# EasyEDA schematic Rollator_2020-08-11_09-29-25.json
TITLE: Rollator; REV: 1.0; Date: 2020-08-06; Sheet: 1/1; Drawn By: grizzie17; Company: Me
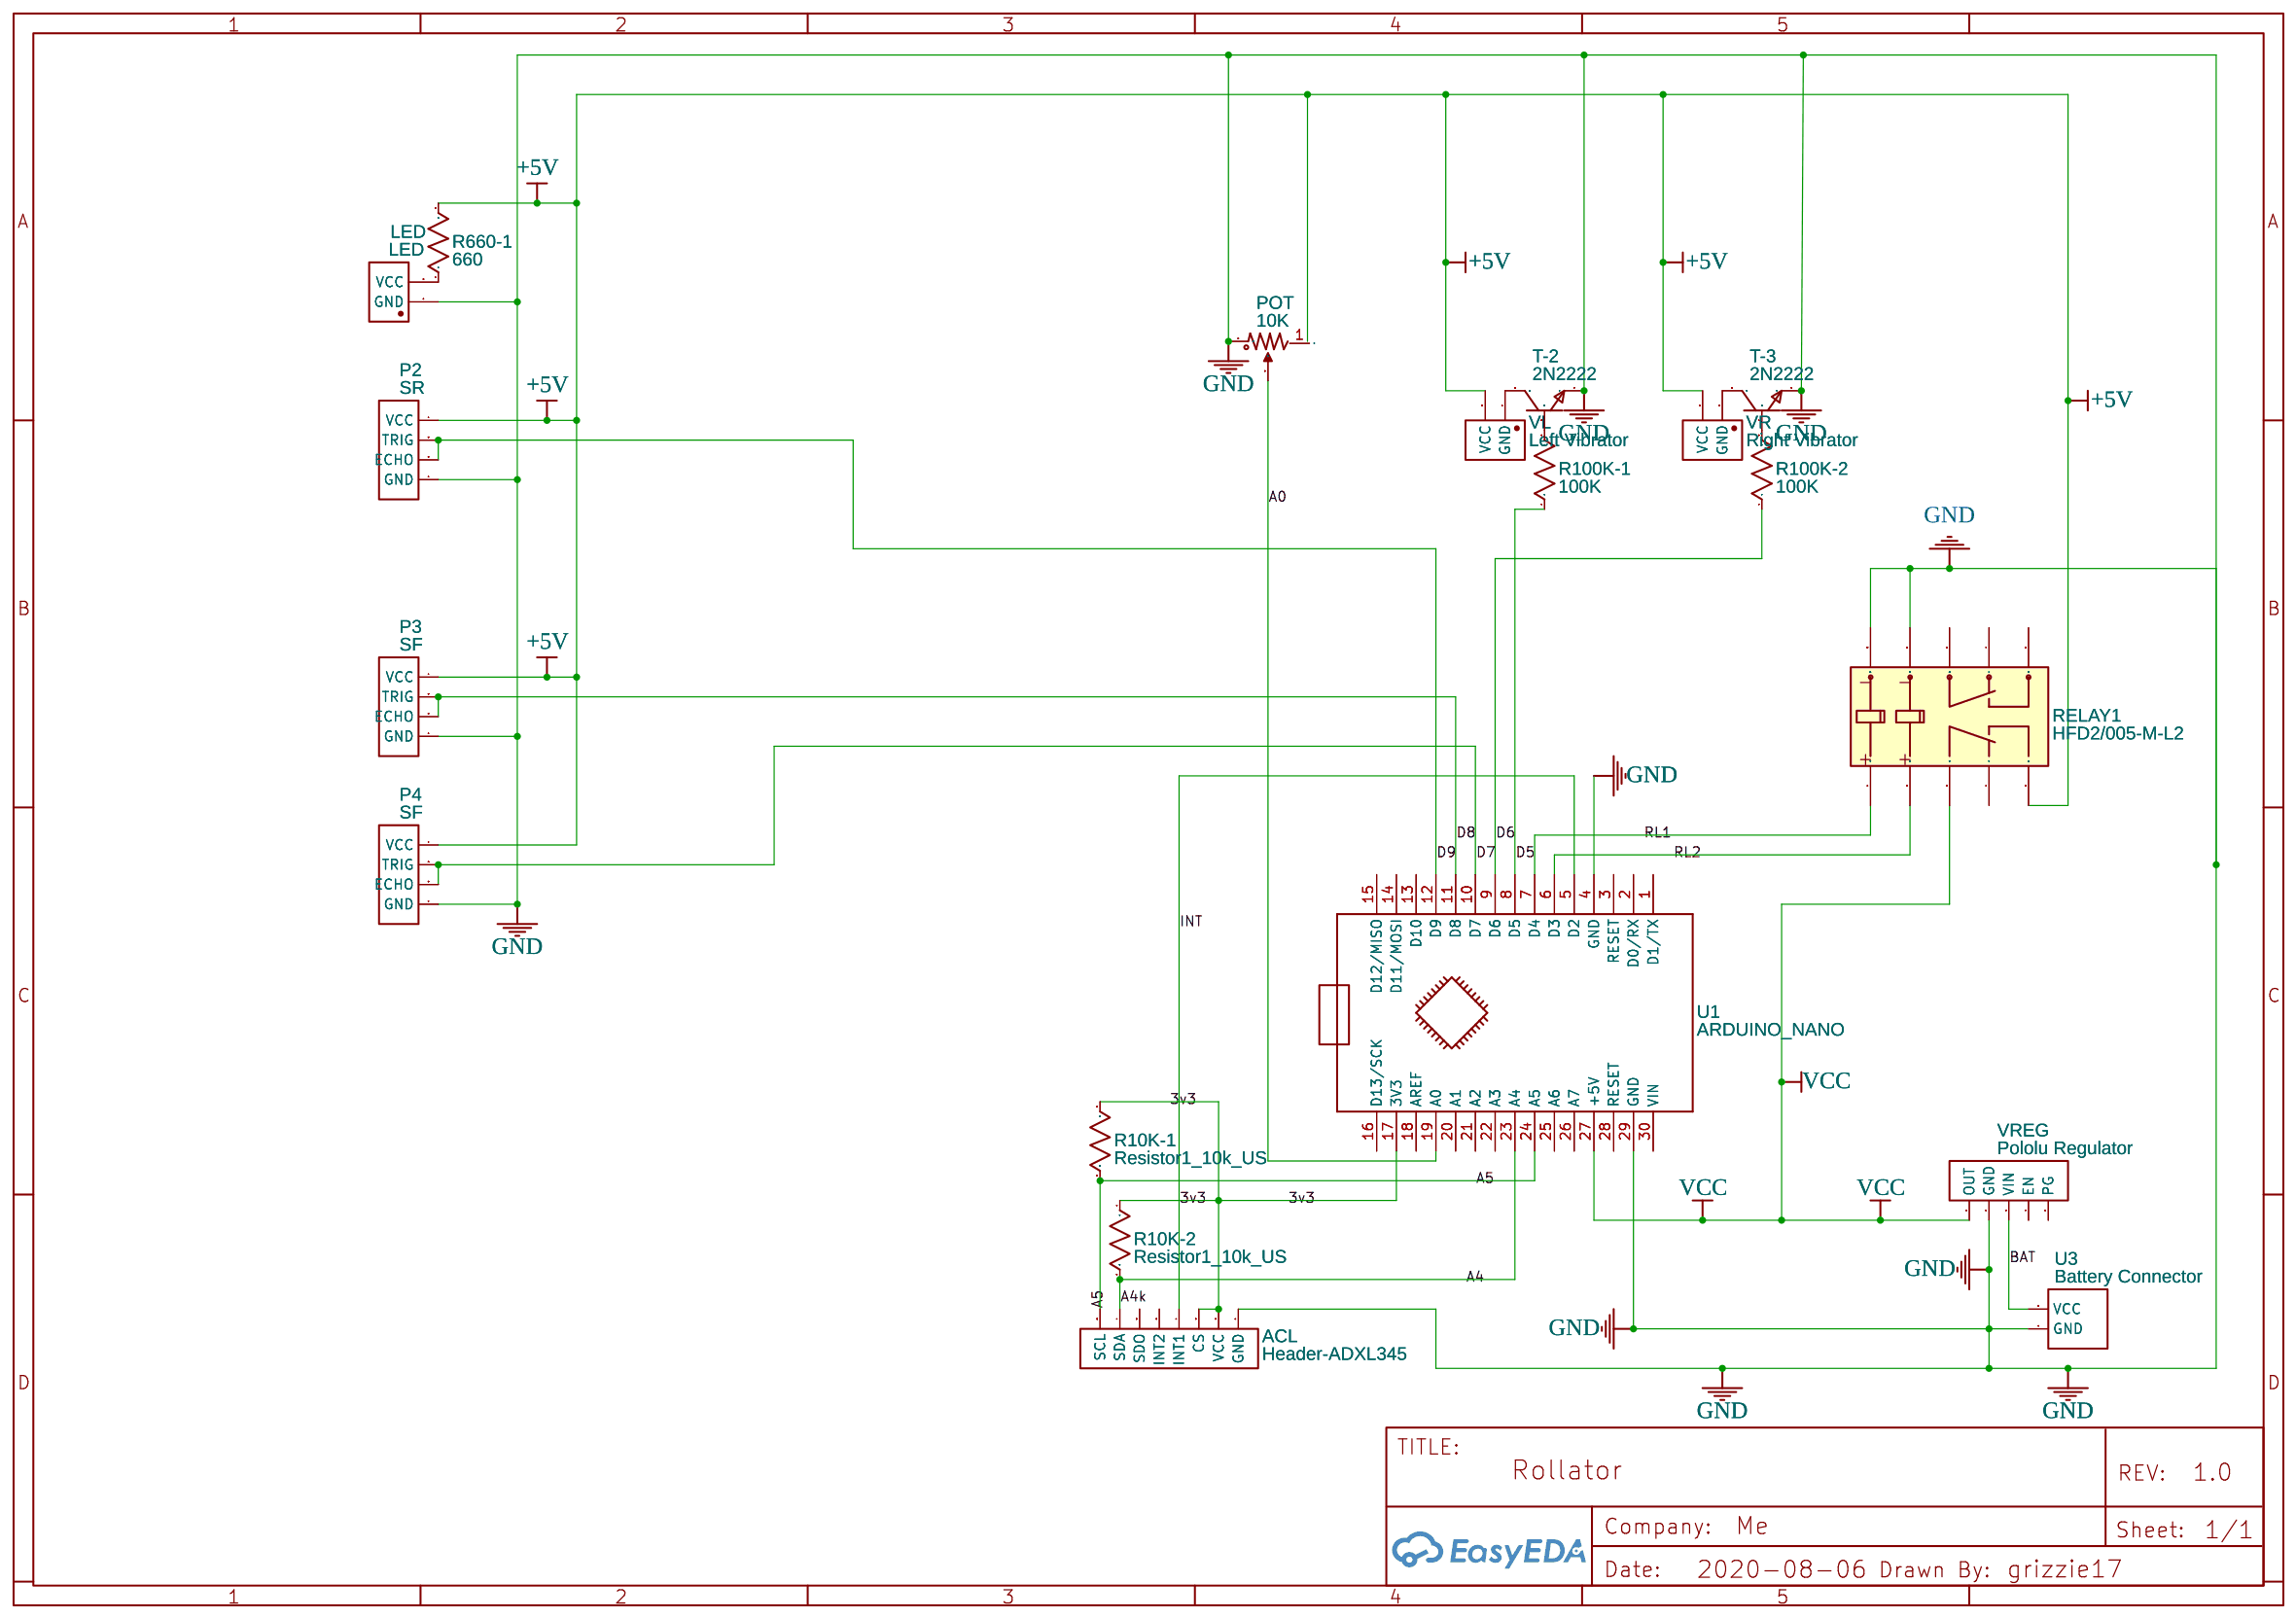
[diagram p0: schematic sheet]

## Parts
ACL  Header-ADXL345  [HDR-TH_8P-P2.54-V]
LED  LED  [HEADER_FEMALE_1X2_2.54]
P2  SR  [HDR-4X1/2.54]
P3  SF  [HDR-4X1/2.54]
P4  SF  [HDR-4X1/2.54]
POT  10K  [TRIM_POT_PTH]
R10K-1  Resistor1_10k_US  [AXIAL-0.3]
R10K-2  Resistor1_10k_US  [AXIAL-0.3]
R100K-1  100K  [R100K]
R100K-2  100K  [R100K]
R660-1  660  [R100K]
RELAY1  HFD2/005-M-L2  [RELAY-HF_15]
T-2  2N2222  [2N2222]
T-3  2N2222  [2N2222]
U1  ARDUINO_NANO  [ARDUINO_NANO]
U3  Battery Connector  [BATTERY CONNECTOR]
VL  Left Vibrator  [HEADER_FEMALE_1X2_2.54]
VR  Right Vibrator  [HEADER_FEMALE_1X2_2.54]
VREG  Pololu Regulator  [HDR-TH_5P-P2.54-V]

## Library data of the parts
ACL = Header-Female-2.54_1x8: Supplier: LCSC; Manufacturer: BOOMELE; Manufacturer Part: Female headerHDR1X8-2.54; Supplier Part: C27438; Package Display: No
LED = Header_Female_1X2_2_54: catid: 20; Contributor: Moile-EasyEDA; sim: true; Package Display: No
P2-P4 = Header-Female-2.54_1x4: Supplier: LCSC; Manufacturer: ReliaPro; Supplier Part: C124413; Package Display: No
POT = Potentiometer: K(%): 50
R10K-1 R10K-2 = Resistor1_10k_US: Resistance: 10k; Contributor: kpk.cbe; Supplier: YUJING; sim: true
R100K-1 R100K-2 R660-1 = 100K: sourceId: zmSasKEkC; sim: true; Contributor: Ashwinkmenon
RELAY1 = HFD2/005-M-L2: Supplier: LCSC; Manufacturer: HF; Manufacturer Part: HFD2/003-S-L2; Contributor: LCSC; Supplier Part: C69851
T-2 T-3 = 2N2222: Supplier: LCSC; Manufacturer: SEMTECH; Contributor: hammad shamim; Supplier Part: C118536
U1 = ARDUINO_NANO: sourceId: KGSeAWhDB
U3 = Battery Connector: Contributor: circuitmaker5000
VL VR = Header_Female_1X2_2_54: catid: 20; Contributor: Moile-EasyEDA; sim: true
VREG = Header-Female-2.54_1x5: Supplier: LCSC; Manufacturer: BOOMELE; Manufacturer Part: 2.54mm 1*5p Female header; image: //image.lceda.cn/szlcsc/C50950.jpg; Supplier Part: C50950; Package Display: No

## Nets
3v3: ACL.2(VCC) ACL.3(CS) ACL.4(INT1) R10K-1.1 R10K-2.1 U1.5(D2) U1.17(3V3)
+5V: P2.4(VCC) P3.4(VCC) P4.4(VCC) POT.1 R660-1.2 RELAY1.5 VL.2(VCC) VR.2(VCC)
GND: ACL.1(GND) LED.1(GND) P2.1(GND) P3.1(GND) P4.1(GND) POT.3(2) RELAY1.9 RELAY1.10 T-2.1(E) T-3.1(E) U1.4(GND) U1.29(GND) U3.1(GND) VREG.2(GND)
VCC: RELAY1.3 U1.27(+5V) VREG.1(OUT)
A0: POT.2(3) U1.19(A0)
A4: ACL.7(SDA) R10K-2.2 U1.23(A4)
A5: ACL.8(SCL) R10K-1.2 U1.24(A5)
BAT: U3.2(VCC) VREG.3(VIN)
D5: R100K-1.1 U1.8(D5)
D6: R100K-2.1 U1.9(D6)
D7: P4.2(ECHO) P4.3(TRIG) U1.10(D7)
D8: P3.2(ECHO) P3.3(TRIG) U1.11(D8)
D9: P2.2(ECHO) P2.3(TRIG) U1.12(D9)
RL1: RELAY1.1 U1.7(D4)
RL2: RELAY1.2 U1.6(D3)
Net-(LED-2): LED.2(VCC) R660-1.1
Net-(R100K-1-2): R100K-1.2 T-2.2(B)
Net-(R100K-2-2): R100K-2.2 T-3.2(B)
Net-(T-2-3): T-2.3(C) VL.1(GND)
Net-(T-3-3): T-3.3(C) VR.1(GND)

Not connected (* = marked no-connect by the designer): ACL 5(INT2) 6(SDO); RELAY1 4 6 7 8; U1 1(D1/TX) 2(D0/RX) 3(RESET) 13(D10) 14(D11/MOSI) 15(D12/MISO) 16(D13/SCK) 18(AREF) 20(A1) 21(A2) 22(A3) 25(A6) 26(A7) 28(RESET) 30(VIN); VREG 4(EN) 5(PG)
